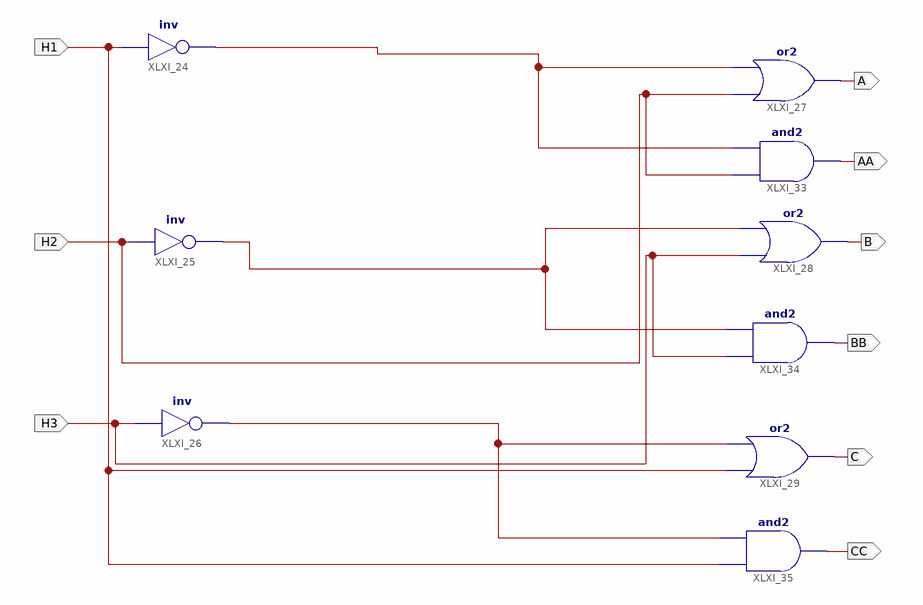
[diagram p0: schematic sheet 1]
// Xilinx ISE schematic Commutation.sch (spartan3e) as structural Verilog: 9 symbols, 9 ports
module Commutation (
  input  H1,
  input  H2,
  input  H3,
  output A,
  output AA,
  output B,
  output BB,
  output C,
  output CC
);

  wire XLXN_58, XLXN_59, XLXN_60;

  not XLXI_24 (XLXN_59, H1);
  not XLXI_25 (XLXN_60, H2);
  not XLXI_26 (XLXN_58, H3);
  or XLXI_27 (A, H2, XLXN_59);
  or XLXI_29 (C, H1, XLXN_58);
  or XLXI_28 (B, H3, XLXN_60);
  and XLXI_33 (AA, H2, XLXN_59);
  and XLXI_34 (BB, H3, XLXN_60);
  and XLXI_35 (CC, H1, XLXN_58);
endmodule
